# Altium schematic sheet Main.SchDoc
size A4
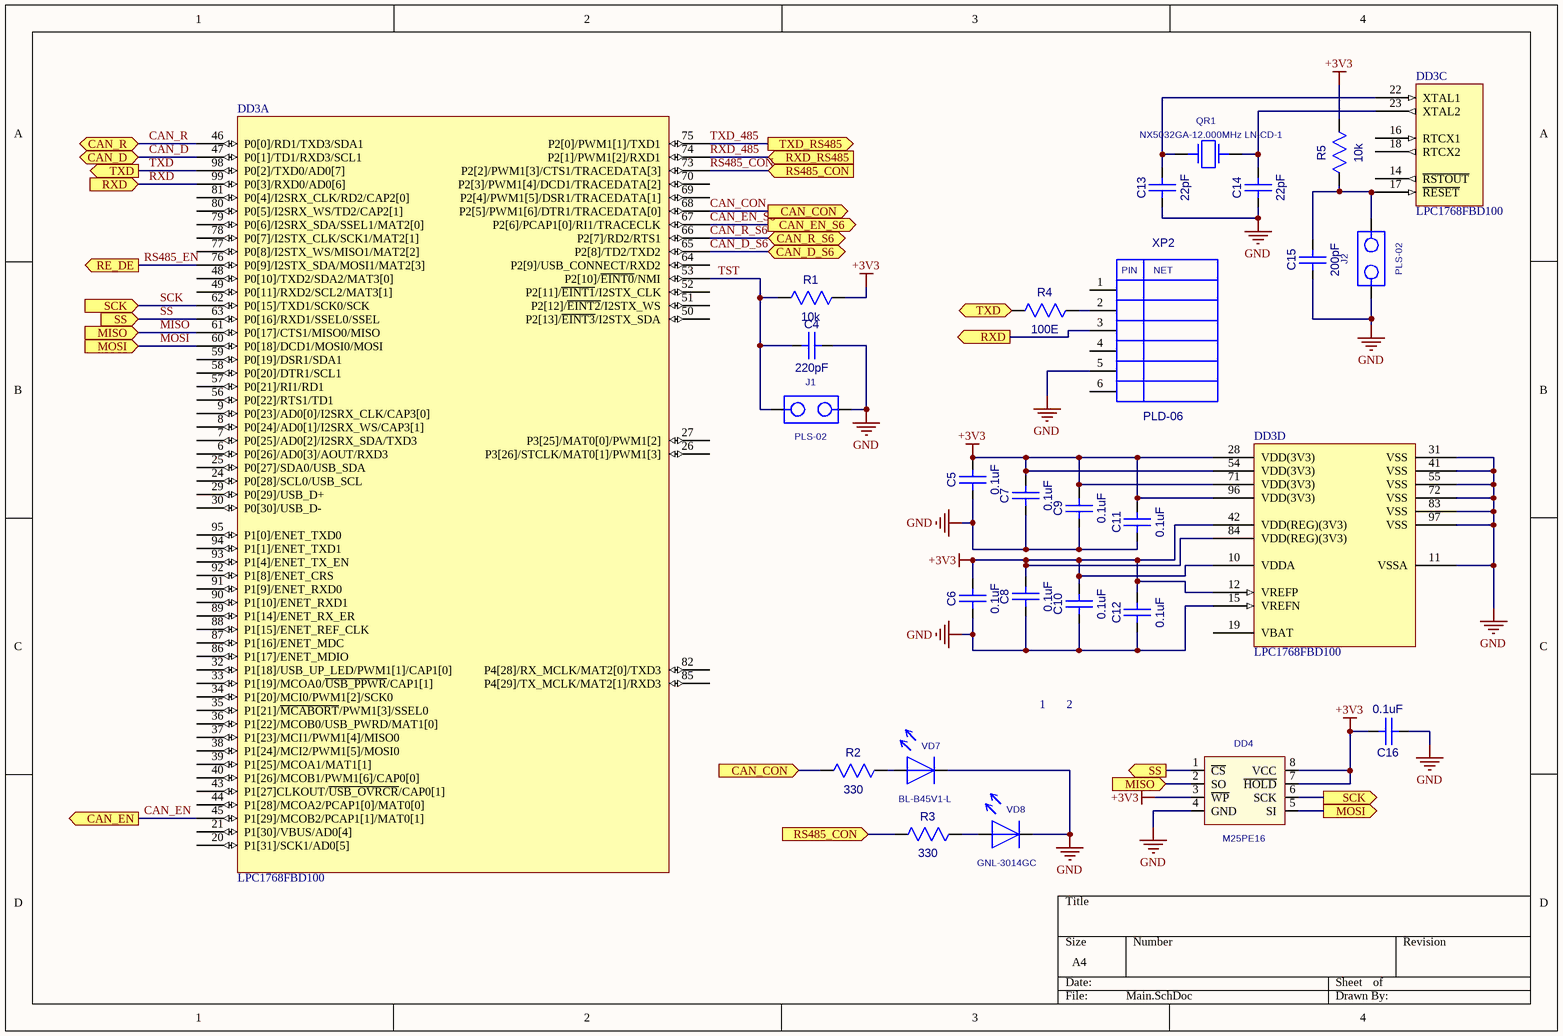
[diagram p0: Main.SchDoc]

## Parts
1  REPER1.2  [REPER1.2]  (value not drawn)
2  REPER1.2  [REPER1.2]  (value not drawn)
C4  220pF  [CC0603-3M]
C5  0.1uF  [CC0603-3M]
C6  0.1uF  [CC0603-3M]
C7  0.1uF  [CC0603-3M]
C8  0.1uF  [CC0603-3M]
C9  0.1uF  [CC0603-3M]
C10  0.1uF  [CC0603-3M]
C11  0.1uF  [CC0603-3M]
C12  0.1uF  [CC0603-3M]
C13  22pF  [CC0603-3M]
C14  22pF  [CC0603-3M]
C15  200pF  [CC0603-3M]
C16  0.1uF  [CC0603-3M]
DD3  LPC1768FBD100  [TQFP-100]  (parts A,C,D of 4)
DD4  M25PE16  [EIAJ_SO8]
J1  PLS-02  [PLS-02]
J2  PLS-02  [PIN2W]
QR1  NX5032GA-12.000MHz LN-CD-1  [AC5032_2]
R1  10k  [RC0603-3M]
R2  330  [RC0603-3M]
R3  330  [RC0603-3M]
R4  100E  [RC0603-3M]
R5  10k  [RC0603-3M]
VD7  BL-B45V1-L  [LED3]
VD8  GNL-3014GC  [LED3]
XP2  PLD-06  [PLD-06]

## Ports
CAN_CON (in), CAN_CON (out), CAN_D, CAN_D_S6, CAN_EN (out), CAN_EN_S6 (out), CAN_R, CAN_R_S6, MISO (in), MOSI (in), MOSI (out), RE_DE (out), RS485_CON (in), RXD (in), RXD (out), RXD_RS485 (in), SCK (in), SCK (out), SS (in), SS (out), TXD (in), TXD (out), TXD_RS485 (out)

## Nets
+3V3: C5.2(B) C6.2(B) C7.2(B) C8.2(B) C9.2(B) C10.2(B) C11.2(B) C12.2(B) C16.2(B) DD3.10(VDDA) DD3.12(VREFP) DD3.28(VDD(3V3)) DD3.42(VDD(REG)(3V3)) DD3.54(VDD(3V3)) DD3.71(VDD(3V3)) DD3.84(VDD(REG)(3V3)) DD3.96(VDD(3V3)) DD4.3(~{WP}) DD4.7(~{HOLD}) DD4.8(VCC) R1.2(B) R5.2(B)
GND: C4.2(B) C5.1(A) C6.1(A) C7.1(A) C8.1(A) C9.1(A) C10.1(A) C11.1(A) C12.1(A) C13.1(A) C14.1(A) C15.1(A) C16.1(A) DD3.11(VSSA) DD3.15(VREFN) DD3.31(VSS) DD3.41(VSS) DD3.55(VSS) DD3.72(VSS) DD3.83(VSS) DD3.97(VSS) DD4.4(GND) J1.2 J2.1 VD7.1 VD8.1 XP2.5
CAN_CON: DD3.68(P2[5]/PWM1[6]/DTR1/TRACEDATA[0]) R2.1(A) ; port CAN_CON
CAN_D: DD3.47(P0[1]/TD1/RXD3/SCL1) ; port CAN_D
CAN_D_S6: DD3.65(P2[8]/TD2/TXD2) ; port CAN_D_S6
CAN_EN: DD3.45(P1[29]/MCOB2/PCAP1[1]/MAT0[1]) ; port CAN_EN
CAN_EN_S6: DD3.67(P2[6]/PCAP1[0]/RI1/TRACECLK) ; port CAN_EN_S6
CAN_R: DD3.46(P0[0]/RD1/TXD3/SDA1) ; port CAN_R
CAN_R_S6: DD3.66(P2[7]/RD2/RTS1) ; port CAN_R_S6
MISO: DD3.61(P0[17]/CTS1/MISO0/MISO) DD4.2(SO) ; port MISO
MOSI: DD3.60(P0[18]/DCD1/MOSI0/MOSI) DD4.5(SI) ; port MOSI
RS485_CON: DD3.73(P2[2]/PWM1[3]/CTS1/TRACEDATA[3]) R3.1(A) ; port RS485_CON
RS485_EN: DD3.76(P0[9]/I2STX_SDA/MOSI1/MAT2[3]) ; port RE_DE
RXD: DD3.99(P0[3]/RXD0/AD0[6]) XP2.3 ; port RXD
RXD_485: DD3.74(P2[1]/PWM1[2]/RXD1) ; port RXD_RS485
SCK: DD3.62(P0[15]/TXD1/SCK0/SCK) DD4.6(SCK) ; port SCK
SS: DD3.63(P0[16]/RXD1/SSEL0/SSEL) DD4.1(~{CS}) ; port SS
TST: C4.1(A) DD3.53(P2[10]/~{EINT0}/NMI) J1.1 R1.1(A)
TXD: DD3.98(P0[2]/TXD0/AD0[7]) R4.1(A) ; port TXD
TXD_485: DD3.75(P2[0]/PWM1[1]/TXD1) ; port TXD_RS485
NetC13_2: C13.2(B) DD3.22(XTAL1) QR1.1
NetC14_2: C14.2(B) DD3.23(XTAL2) QR1.2
NetC15_2: C15.2(B) DD3.17(~{RESET}) J2.2 R5.1(A)
NetR2_2: R2.2(B) VD7.2
NetR3_2: R3.2(B) VD8.2
NetR4_2: R4.2(B) XP2.2

Not connected (* = marked no-connect by the designer): 1 1; 2 1; DD3 6(P0[26]/AD0[3]/AOUT/RXD3) 7(P0[25]/AD0[2]/I2SRX_SDA/TXD3) 8(P0[24]/AD0[1]/I2SRX_WS/CAP3[1]) 9(P0[23]/AD0[0]/I2SRX_CLK/CAP3[0]) 14(~{RSTOUT}) 16(RTCX1) 18(RTCX2) 19(VBAT) 20(P1[31]/SCK1/AD0[5]) 21(P1[30]/VBUS/AD0[4]) 24(P0[28]/SCL0/USB_SCL) 25(P0[27]/SDA0/USB_SDA) 26(P3[26]/STCLK/MAT0[1]/PWM1[3]) 27(P3[25]/MAT0[0]/PWM1[2]) 29(P0[29]/USB_D+) 30(P0[30]/USB_D-) 32(P1[18]/USB_UP_LED/PWM1[1]/CAP1[0]) 33(P1[19]/MCOA0/~{USB_PPWR}/CAP1[1]) 34(P1[20]/MCI0/PWM1[2]/SCK0) 35(P1[21]/~{MCABORT}/PWM1[3]/SSEL0) 36(P1[22]/MCOB0/USB_PWRD/MAT1[0]) 37(P1[23]/MCI1/PWM1[4]/MISO0) 38(P1[24]/MCI2/PWM1[5]/MOSI0) 39(P1[25]/MCOA1/MAT1[1]) 40(P1[26]/MCOB1/PWM1[6]/CAP0[0]) 43(P1[27]CLKOUT/~{USB_OVRCR}/CAP0[1]) 44(P1[28]/MCOA2/PCAP1[0]/MAT0[0]) 48(P0[10]/TXD2/SDA2/MAT3[0]) 49(P0[11]/RXD2/SCL2/MAT3[1]) 50(P2[13]/~{EINT3}/I2STX_SDA) 51(P2[12]/~{EINT2}/I2STX_WS) 52(P2[11]/~{EINT1}/I2STX_CLK) 56(P0[22]/RTS1/TD1) 57(P0[21]/RI1/RD1) 58(P0[20]/DTR1/SCL1) 59(P0[19]/DSR1/SDA1) 64(P2[9]/USB_CONNECT/RXD2) 69(P2[4]/PWM1[5]/DSR1/TRACEDATA[1]) 70(P2[3]/PWM1[4]/DCD1/TRACEDATA[2]) 77(P0[8]/I2STX_WS/MISO1/MAT2[2]) 78(P0[7]/I2STX_CLK/SCK1/MAT2[1]) 79(P0[6]/I2SRX_SDA/SSEL1/MAT2[0]) 80(P0[5]/I2SRX_WS/TD2/CAP2[1]) 81(P0[4]/I2SRX_CLK/RD2/CAP2[0]) 82(P4[28]/RX_MCLK/MAT2[0]/TXD3) 85(P4[29]/TX_MCLK/MAT2[1]/RXD3) 86(P1[17]/ENET_MDIO) 87(P1[16]/ENET_MDC) 88(P1[15]/ENET_REF_CLK) 89(P1[14]/ENET_RX_ER) 90(P1[10]/ENET_RXD1) 91(P1[9]/ENET_RXD0) 92(P1[8]/ENET_CRS) 93(P1[4]/ENET_TX_EN) 94(P1[1]/ENET_TXD1) 95(P1[0]/ENET_TXD0); XP2 1 4 6

## Notes on the sheet
- (in symbol PLD-06) PIN; NET

## Library data of the parts
C4-C16 = CC0603
  C4: Value: 220pF
  C5-C12 C16: Value: 0.1uF
  C13 C14: Value: 22pF
  C15: Value: 200pF
DD3 = LPC1768FBD100: Cortex -M3 32-Bit Microcontroller, 512KB Flash, 64KB RAM, 100-Lead LQFP; ComponentLink1Description: Manufacturer Link; ComponentLink1URL: http://www.nxp.com/
DD4 = S25FL016A0LMFI01: Value: M25PE16
QR1 = AC5032_2: AC5032/2; Value: NX5032GA-12.000MHz LN-CD-1
R1-R5 = RC0603
  R1 R5: Value: 10k
  R2 R3: Value: 330
  R4: Value: 100E
VD7 VD8 = LED_3
  VD7: Value: BL-B45V1-L
  VD8: Value: GNL-3014GC
XP2 = PLD-06: PLD06; Value: *
1 2 = REPER1.2: Value: *
J1 J2 = PLS-02: Value: *